# Altium schematic sheet Line following robot 101824.SchDoc: Line following robot
size A4; Date: 2.10.2024.; ApprovedBy: Prof dr Goran Nikolić; Author: Bogdan Kostić; DrawnBy: Bogdan Kostić; DocumentNumber: 1; Revision: 10; SheetNumber: 1; SheetTotal: 1
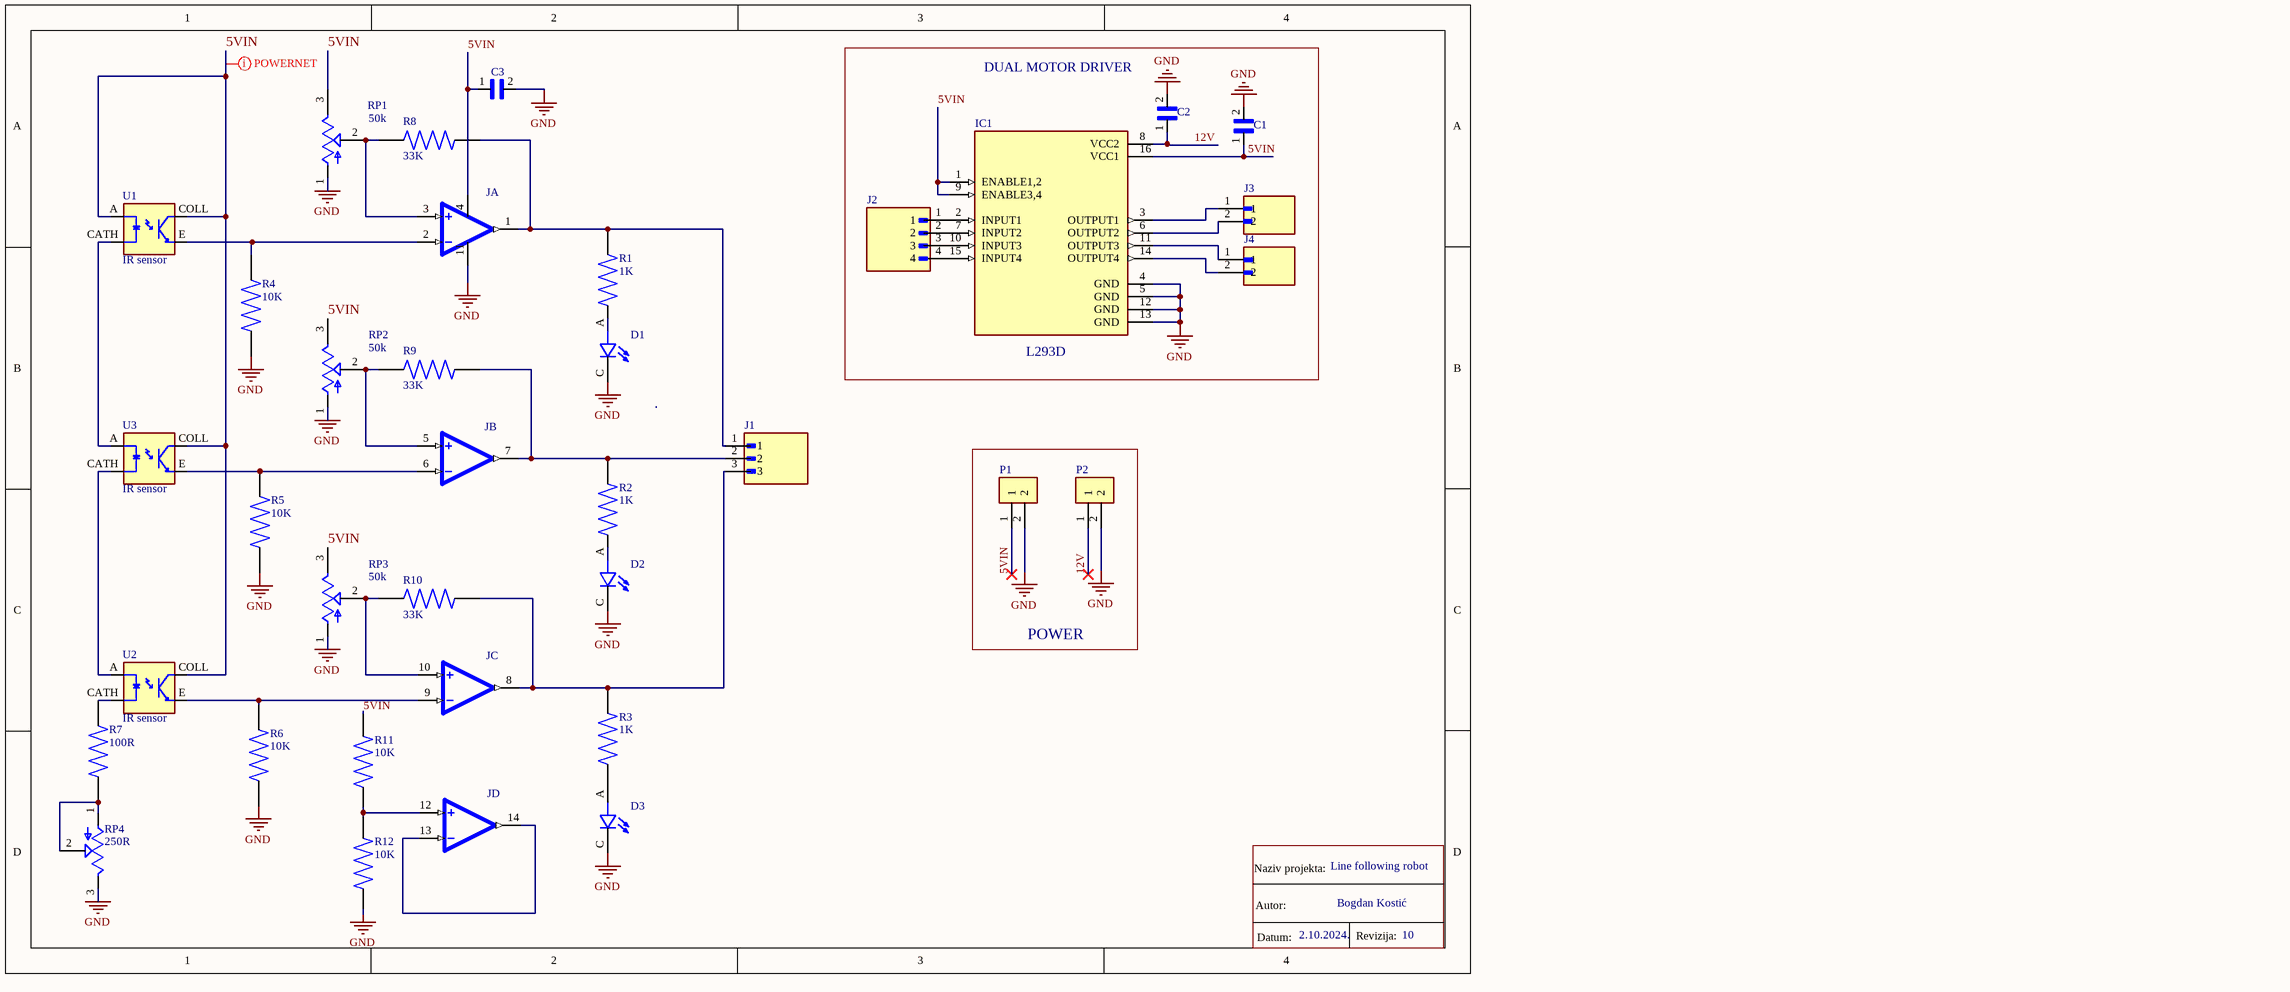
[diagram p0: Line following robot 101824.SchDoc]

## Parts
C1  (no value)  [CAPRB500W50L450T300H550]
C2  (no value)  [CAPRB500W50L450T300H550]
C3  (no value)  [CAPRB500W50L450T300H550]
D1  (no value)  [LEDRD254W50D500H1060]
D2  (no value)  [LEDRD254W50D500H1060]
D3  (no value)  [LEDRD254W50D500H1060]
IC1  L293D  [DIP880W50P254L2000H510Q16]
J  (no value)  [DIP825W47P254L1917H533Q14]  (parts A,B,C,D of 4)
J1  (no value)  [HARWIN_M20-9990345]
J2  (no value)  [4 pin header 1 2 3 4]
J3  (no value)  [TE_5-146278-2]
J4  (no value)  [TE_5-146278-2]
P1  (no value)  [TE_282837-2]
P2  (no value)  [TE_282837-2]
R1  1K  [Otpornik 1k Ohm]
R2  1K  [Otpornik 1k Ohm]
R3  1K  [Otpornik 1k Ohm]
R4  10K  [10k]
R5  10K  [10k]
R6  10K  [10k]
R7  100R  [100R]
R8  33K  [RESAD1100W55L680D260]
R9  33K  [RESAD1100W55L680D260]
R10  33K  [RESAD1100W55L680D260]
R11  10K  [10k]
R12  10K  [10k]
RP1  50k  [TRIM_3296W-1-250]
RP2  50k  [TRIM_3296W-1-250]
RP3  50k  [TRIM_3296W-1-250]
RP4  250R  [TRIM_3296W-1-250]
U1  IR sensor  [OPTO_TCRT5000 verzija2]
U2  IR sensor  [OPTO_TCRT5000 verzija2]
U3  IR sensor  [OPTO_TCRT5000 verzija2]

## Blocks framed on the sheet
DUAL MOTOR DRIVER: C1 C2 IC1 J2-J4
POWER: P1 P2

## Nets
GND: C1.2 C2.2 C3.2 D1.C D2.C D3.C IC1.4(GND) IC1.5(GND) IC1.12(GND) IC1.13(GND) P1.2 P2.2 R4.1 R5.1 R6.1 R12.1 RP1.1(CCW) RP2.1(CCW) RP3.1(CCW) RP4.3(CW)
5VIN: C1.1 C3.1 IC1.1(ENABLE1,2) IC1.9(ENABLE3,4) IC1.16(VCC1) P1.1 R11.2 RP1.3(CW) RP2.3(CW) RP3.3(CW) U1.A U1.COLL U2.COLL U3.COLL
12V: C2.1 IC1.8(VCC2) P2.1
NetD1_A: D1.A R1.2
NetD2_A: D2.A R2.2
NetD3_A: D3.A R3.2
NetIC1_2: IC1.2(INPUT1) J2.1
NetIC1_3: IC1.3(OUTPUT1) J3.1
NetIC1_6: IC1.6(OUTPUT2) J3.2
NetIC1_7: IC1.7(INPUT2) J2.2
NetIC1_10: IC1.10(INPUT3) J2.3
NetIC1_11: IC1.11(OUTPUT3) J4.1
NetIC1_14: IC1.14(OUTPUT4) J4.2
NetIC1_15: IC1.15(INPUT4) J2.4
NetJ_1: J.1(1OUT) J1.1 R1.1 R8.1
NetJ_2: J.2(1IN-) R4.2 U1.E
NetJ_3: J.3(1IN+) R8.2 RP1.2(WIPER)
NetJ_5: J.5(2IN+) R9.2 RP2.2(WIPER)
NetJ_6: J.6(2IN-) R5.2 U3.E
NetJ_7: J.7(2OUT) J1.2 R2.1 R9.1
NetJ_8: J.8(3OUT) J1.3 R3.1 R10.1
NetJ_9: J.9(3IN-) R6.2 U2.E
NetJ_10: J.10(3IN+) R10.2 RP3.2(WIPER)
NetJ_12: J.12(4IN+) R11.1 R12.2
NetJ_13: J.13(4IN-) J.14(4OUT)
NetR7_1: R7.1 RP4.1(CCW) RP4.2(WIPER)
NetR7_2: R7.2 U2.CATH
NetU1_CATH: U1.CATH U3.A
NetU2_A: U2.A U3.CATH

Not connected (* = marked no-connect by the designer): J 4(V+) 11(GND)

## Layout directives
net class POWERNET: 5VIN

## Notes on the sheet
- Naziv projekta:
- Autor:
- Datum:
- Revizija:

## Library data of the parts
C1-C3 = FG24X7R1H105KRT06: Cap Ceramic 100nF 50V X7R 10% Radial 5mm 125Â°C Tape; MF: TDK; Package: Radial TDK; Price: None; SnapEDA_Link: https://www.snapeda.com/parts/FG24X7R1H105KRT06/TDK/view-part/?ref=snap; Purchase-URL: https://pricing.snapeda.com/search/part/FG24X7R1H105KRT06/?ref=eda; Value: *; Check_prices: https://www.snapeda.com/parts/FG24X7R1H105KRT06/TDK/view-part/?ref=eda; MP: FG24X7R1H105KRT06; Availability: In Stock
D1-D3 = L-53GD: LED 5mm Green 568nm 20mcd/10mA 60Â°; MF: Kingbright; Value: *; Package: CDIP-28; Check_prices: https://www.snapeda.com/parts/L-53GD/Kingbright/view-part/?ref=eda; MP: L-53GD; Price: None; SnapEDA_Link: https://www.snapeda.com/parts/L-53GD/Kingbright/view-part/?ref=snap; Availability: Unavailable
IC1 = L293D: Bipolar Motor Driver - Parallel 16-PowerDIP; MF: STMicroelectronics; MP: L293D; Package: DIP-16 STMicroelectronics; SnapEDA_Link: https://www.snapeda.com/parts/L293D/STMicroelectronics/view-part/?ref=snap; Purchase-URL: https://pricing.snapeda.com/search/part/L293D/?ref=eda; Check_prices: https://www.snapeda.com/parts/L293D/STMicroelectronics/view-part/?ref=eda; Availability: In Stock; Value: *; Price: None
J = LM324N/NOPB: Quad, 30-V, 1.2-MHz operational amplifier; MF: Texas Instruments; MP: LM324N; SnapEDA_Link: https://www.snapeda.com/parts/LM324N/Texas+Instruments/view-part/?ref=snap; Package: PDIP-14 Texas Instruments; Value: *; Check_prices: https://www.snapeda.com/parts/LM324N/Texas+Instruments/view-part/?ref=eda
J1 = M20-9990345: 2.54mm (0.1) Pitch SIL Vertical Throughboard Pin Header, 6.1mm mating pin height, gold (hi-temp mould), 3 contacts; MF: Harwin; SnapEDA_Link: https://www.snapeda.com/parts/M20-9990345/Harwin+Inc./view-part/?ref=snap; Package: None; Value: *; MP: M20-9990345; Check_prices: https://www.snapeda.com/parts/M20-9990345/Harwin+Inc./view-part/?ref=eda
J2 = MTSW-104-08-L-S-315: Availability: Unavailable; Price: None; MP: MTSW-104-08-L-S-315; Value: *; Package: None
J3 J4 = 5-146278-2: 02 MODII HDR SRST B/A .100CL; MF: TE Connectivity; Number_of_Positions: 2; Centerline_Pitch: 2.54 mm[.1 in]; Product_Type: Connector; Value: *; SnapEDA_Link: https://www.snapeda.com/parts/5-146278-2/TE%20Connectivity%20AMP%20Connectors/view-part/1237793/?ref=snap; Availability: Warning; Price: None; DigiKey-Purchase-URL: https://snapeda.com/shop?store=DigiKey&id=1237793; Mouser-Purchase-URL: https://snapeda.com/shop?store=Mouser&id=1237793; Package: None; EU_RoHS_Compliance: Compliant; MP: 5-146278-2
P1 P2 = 282837-2: 2 pin terminal; MF: TE Connectivity; SnapEDA_Link: https://www.snapeda.com/parts/282837-2/TE+Connectivity+AMP+Connectors/view-part/?ref=snap; Price: None; Check_prices: https://www.snapeda.com/parts/282837-2/TE+Connectivity+AMP+Connectors/view-part/?ref=eda; Purchase-URL: https://pricing.snapeda.com/search/part/282837-2/?ref=eda; MP: 282837-2; Value: *; Availability: In Stock; Package: None
R1-R7 R11 R12 = MFR-25FRF52-100R: 100 Ohms Â±1% 0.25W, 1/4W Through Hole Resistor Axial Metal Film; MF: Yageo; Check_prices: https://www.snapeda.com/parts/MFR-25FRF52-100R/Yageo/view-part/3657249/?ref=eda; Purchase-URL: https://pricing.snapeda.com/search/part/MFR-25FRF52-100R/?ref=eda; Value: *; SnapEDA_Link: https://www.snapeda.com/parts/MFR-25FRF52-100R/Yageo/view-part/3657249/?ref=snap; Package: Axial Yageo; MP: MFR-25FRF52-100R; Price: None; Availability: Warning
R8-R10 = MFR-25FBF52-1K: 1.07 kOhms Â±1% 0.25W, 1/4W Through Hole Resistor Axial - Metal Film; MF: Yageo; Value: *; SnapEDA_Link: https://www.snapeda.com/parts/MFR-25FBF52-1K/Yageo/view-part/?ref=snap; Purchase-URL: https://pricing.snapeda.com/search/part/MFR-25FBF52-1K/?ref=eda; Availability: In Stock; Price: None; Package: Axial Yageo; Check_prices: https://www.snapeda.com/parts/MFR-25FBF52-1K/Yageo/view-part/?ref=eda; MP: MFR-25FBF52-1K
RP1-RP3 = 3362P-1-251LF: 50k Ohms 0.5W, 1/2W PC Pins Through Hole Trimmer Potentiometer Cermet 1.0 Turn Top Adjustment; MF: Bourns; Purchase-URL: https://pricing.snapeda.com/search/part/3362P-1-251LF/?ref=eda; Package: 3362P-1 Bourns Inc.; Availability: In Stock; MP: 3362P-1-251LF; Value: *; Check_prices: https://www.snapeda.com/parts/3362P-1-251LF/Bourns/view-part/?ref=eda; SnapEDA_Link: https://www.snapeda.com/parts/3362P-1-251LF/Bourns/view-part/?ref=snap; Price: None
RP4 = 3362P-1-251LF: 250 Ohms 0.5W, 1/2W PC Pins Through Hole Trimmer Potentiometer Cermet 1.0 Turn Top Adjustment; MF: Bourns; Purchase-URL: https://pricing.snapeda.com/search/part/3362P-1-251LF/?ref=eda; Package: 3362P-1 Bourns Inc.; Availability: In Stock; MP: 3362P-1-251LF; Value: *; Check_prices: https://www.snapeda.com/parts/3362P-1-251LF/Bourns/view-part/?ref=eda; SnapEDA_Link: https://www.snapeda.com/parts/3362P-1-251LF/Bourns/view-part/?ref=snap; Price: None
U1-U3 = TCRT5000: 950 nm 60 mA Through Hole Reflective Optical Sensor with Transistor Output; Availability: Unavailable; MP: TCRT5000; Value: *; Price: None; Package: None